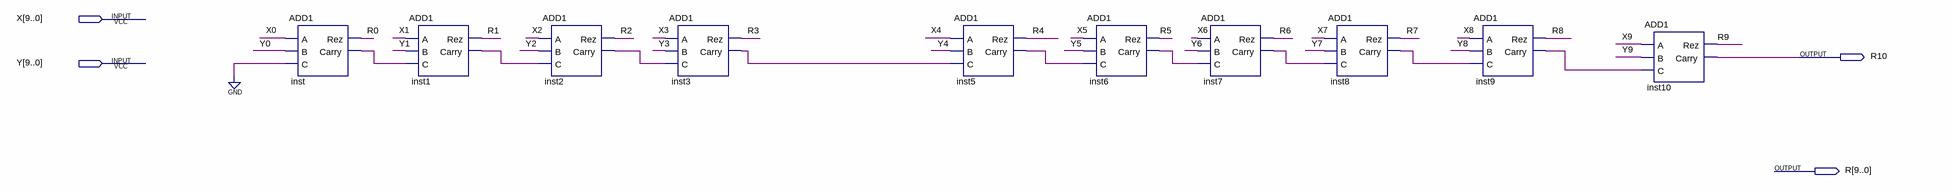
[diagram p0: schematic sheet]
// Quartus schematic ADD10.bdf as structural Verilog: 10 symbols, 4 pins
module ADD10 (
  input  [9:0] X,
  input  [9:0] Y,
  output R10,
  output [9:0] R
);

  wire inst1_carry, inst2_carry, inst3_carry, inst5_carry, inst6_carry, inst7_carry, inst8_carry,
       inst9_carry, inst_carry;

  ADD1 inst (.A(X[0]), .B(Y[0]), .C(1'b0), .Rez(R[0]), .Carry(inst_carry));
  ADD1 inst1 (.A(X[1]), .B(Y[1]), .C(inst_carry), .Rez(R[1]), .Carry(inst1_carry));
  ADD1 inst2 (.A(X[2]), .B(Y[2]), .C(inst1_carry), .Rez(R[2]), .Carry(inst2_carry));
  ADD1 inst3 (.A(X[3]), .B(Y[3]), .C(inst2_carry), .Rez(R[3]), .Carry(inst3_carry));
  ADD1 inst5 (.A(X[4]), .B(Y[4]), .C(inst3_carry), .Rez(R[4]), .Carry(inst5_carry));
  ADD1 inst6 (.A(X[5]), .B(Y[5]), .C(inst5_carry), .Rez(R[5]), .Carry(inst6_carry));
  ADD1 inst7 (.A(X[6]), .B(Y[6]), .C(inst6_carry), .Rez(R[6]), .Carry(inst7_carry));
  ADD1 inst8 (.A(X[7]), .B(Y[7]), .C(inst7_carry), .Rez(R[7]), .Carry(inst8_carry));
  ADD1 inst9 (.A(X[8]), .B(Y[8]), .C(inst8_carry), .Rez(R[8]), .Carry(inst9_carry));
  ADD1 inst10 (.A(X[9]), .B(Y[9]), .C(inst9_carry), .Rez(R[9]), .Carry(R10));
endmodule
